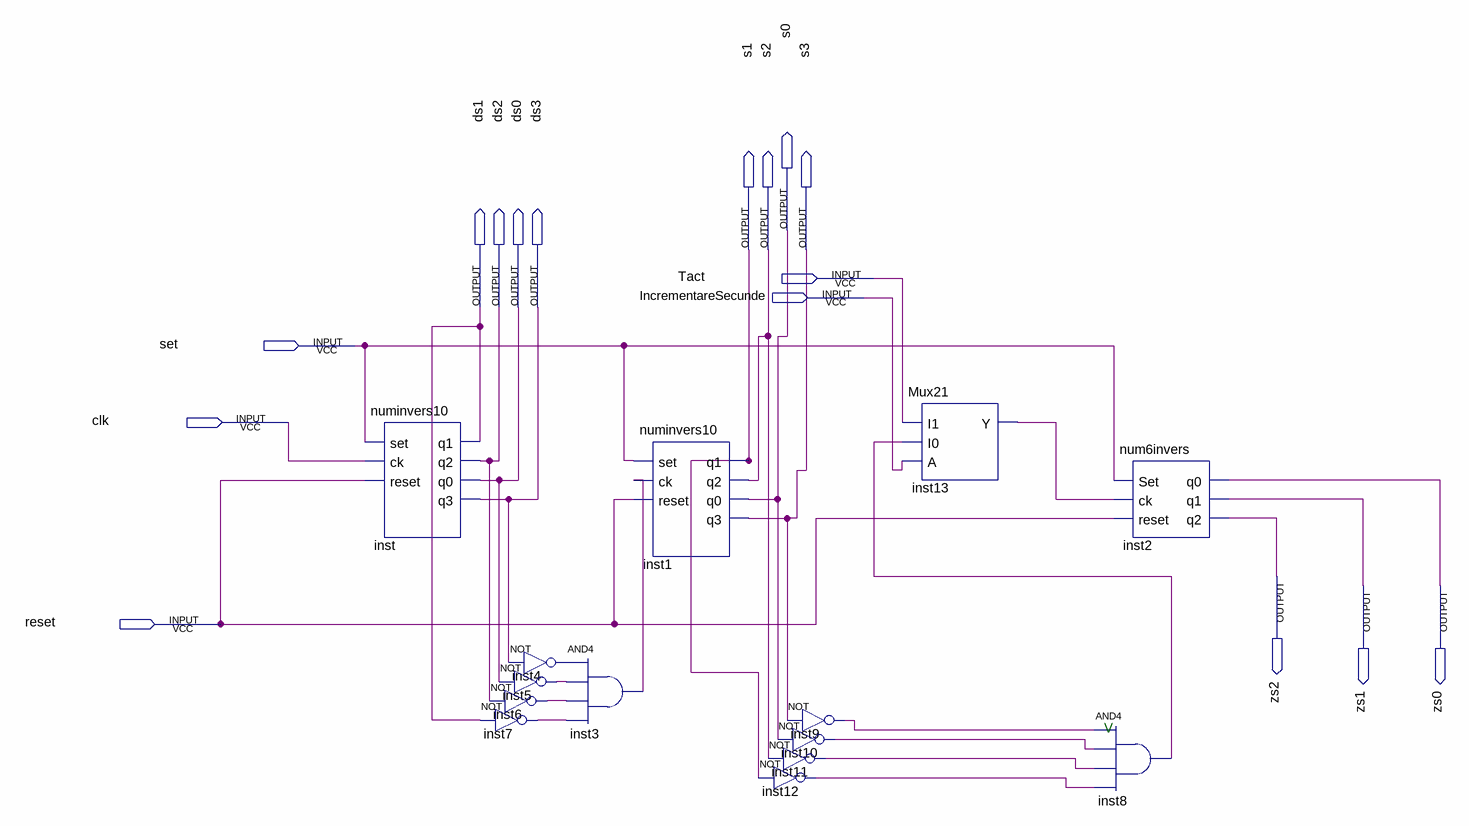
[diagram p0: schematic sheet]
// Quartus schematic numaratorinvers.bdf as structural Verilog: 14 symbols, 16 pins
module numaratorinvers (
  input  Tact,
  input  IncrementareSecunde,
  input  set,
  input  clk,
  input  reset,
  output s0,
  output s1,
  output s2,
  output s3,
  output ds1,
  output ds2,
  output ds0,
  output ds3,
  output zs2,
  output zs1,
  output zs0
);

  wire inst3_out, inst4_out, inst5_out, inst6_out, inst7_out, inst8_out, inst9_out, inst10_out, inst11_out,
       inst12_out, inst13_y;

  numinvers10 inst (.set(set), .ck(clk), .reset(reset), .q1(ds1), .q2(ds2), .q0(ds0), .q3(ds3));
  not inst7 (inst7_out, ds1);
  not inst4 (inst4_out, ds3);
  not inst5 (inst5_out, ds0);
  not inst6 (inst6_out, ds2);
  numinvers10 inst1 (.set(set), .ck(inst3_out), .reset(reset), .q1(s1), .q2(s2), .q0(s0), .q3(s3));
  and inst3 (inst3_out, inst4_out, inst5_out, inst6_out, inst7_out);
  not inst9 (inst9_out, s3);
  not inst10 (inst10_out, s0);
  not inst11 (inst11_out, s2);
  not inst12 (inst12_out, s1);
  Mux21 inst13 (.I1(Tact), .I0(inst8_out), .A(IncrementareSecunde), .Y(inst13_y));
  and inst8 (inst8_out, inst9_out, inst10_out, inst11_out, inst12_out);
  num6invers inst2 (.Set(set), .ck(inst13_y), .reset(reset), .q0(zs0), .q1(zs1), .q2(zs2));

  // Notes on the sheet:
  //   V
endmodule
